# Altium schematic sheet Input_Protection.SchDoc
size A; SheetNumber: 2; SheetTotal: 4
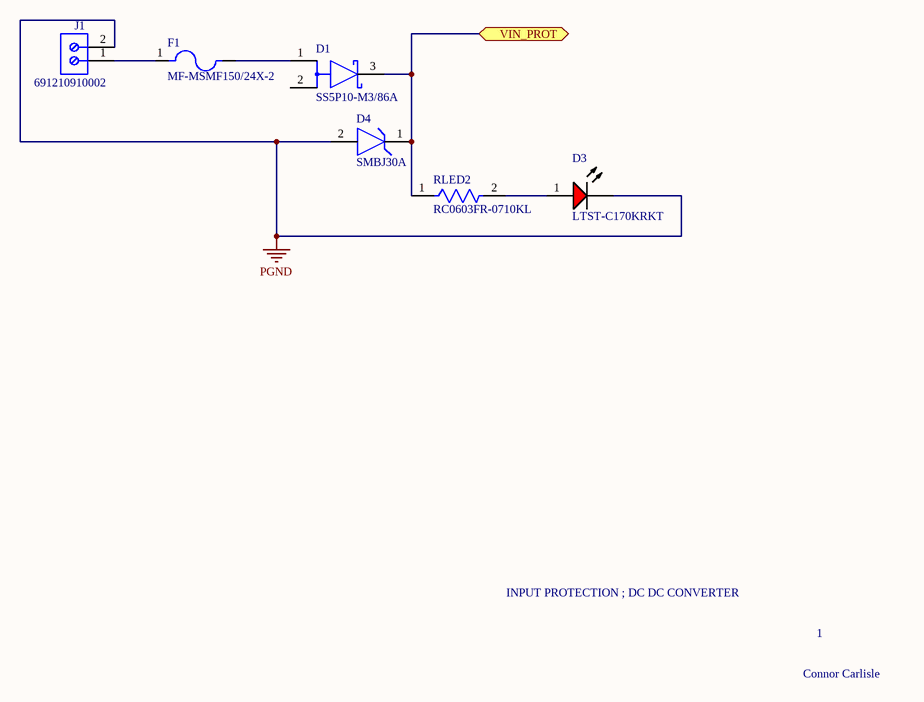
[diagram p0: Input_Protection.SchDoc]

## Parts
D1  SS5P10-M3/86A  [FP-95570-MFG]
D3  LTST-C170KRKT  [LTST-C170KRKT_V]
D4  SMBJ30A  [FP-DO-214AA_SMB_J-Bend-MFG]
F1  MF-MSMF150/24X-2  [FUSER_MF-MSMF150/24X-2]
J1  691210910002  [691210910002]
RLED2  RC0603FR-0710KL  [FP-RC0603-0_55-IPC_C]

## Ports
VIN_PROT (bidir, see Top[2B], Controller[1A], Controller[1C], Controller[4C], Power_Stage[1B])

## Nets
PGND: D3.2(K) D4.2(A) J1.2
VIN_PROT: D1.3(C) D4.1(C) RLED2.1 ; port VIN_PROT
NetD1_1: D1.1(A) F1.2
NetD3_1: D3.1(A) RLED2.2
NetF1_1: F1.1 J1.1

Not connected (* = marked no-connect by the designer): D1 2(A)

## Notes on the sheet
- INPUT PROTECTION ; DC DC CONVERTER
- 1
- Connor Carlisle

## Library data of the parts
D1 = CMP-02539-000057-1: DIODE SCHOTTKY 100V 5A TO277A; Max Forward Surge Current (Ifsm): 150A; Element Configuration: Common Cathode; Max Reverse Leakage Current: 15uA; Forward Voltage: 880mV; Case/Package: TO-277A; Number of Pins: 3; Max Reverse Voltage (DC): 100V; Height: 0.031inch; Peak Non-Repetitive Surge Current: 150A; Series: eSMP®; Radiation Hardening: No; Length: 0.242inch; Max Repetitive Reverse Voltage (Vrrm): 100V; Forward Current: 5A; Width: 0.171inch; Min Operating Temperature: -55°C; Max Surge Current: 150A; Lead Free: Lead Free; RoHS Compliant: Yes; Average Rectified Current: 5A; Max Operating Temperature: 150°C; Max Reverse Current: 15uA; Package Quantity: 1500; Packaging: Tape and Reel; Mount: Surface Mount
D3 = CMP-2000-07593-1: LED Red, 75 mW, 54 mcd, -55 to 85 degC, 2-Pin SMD, RoHS, Tape and Reel; Manufacturer: Lite-On; Lens Transparency: Clear; Number of Elements: 1; Power Rating: 75mW; Luminous Intensity: 54mcd; Viewing Angle: 130degrees; Forward Current: 30mA; Wavelength: 639nm; Lens Style: Rectangular; Case\/Package: 0805; Test Current: 20mA; Dominant Wavelength: 631nm; Forward Voltage: 2V; Lens Colour: Colorless; Min Operating Temperature: -55degC; RoHSCompliant: True; Length: 3.2mm; Width: 1.25mm; Mount: SurfaceMount; Packaging: TapeandReel; Number of LEDs: 1; Radiation Hardening: No; Datasheet URL: http://optoelectronics.liteon.com/upload/download/DS-22-99-0150/LTST-C170KRKT.pdf; Datasheet Version: Rev. D, 11/2014; Case Code (Metric): 2012; Height: 1.1mm; Number of Pins: 2; Package Description: 2-Pin Surface Mount Device, Body 2 x 1.25 mm; Manufacturer URL: http://www.us.liteon.com/; Lead Free: LeadFree; Illumination Colour: Red; Colour: Red; Case Code (Imperial): 0805; Max Operating Temperature: 85degC; Power Dissipation: 75mW; Mounting Technology: SurfaceMount; Package Reference: C170KRKT; Package Quantity: 1; Depth: 1.6mm
D4 = CMP-00227-00050034-1: SMBJ30A SMBJ Series 48.4 V 0.6 kW Surface Mount Uni-Directional TVS Diode - DO-214AA; NexarPartId: 50034; Manufacturer Package Identifier: DO-214AA (SMB J-Bend); Max Power Dissipation: 5W; Number of Channels: 1; Leakage Current: 1µA; Reverse Breakdown Voltage: 33.3V; Test Current: 1mA; Reverse Voltage: 30V; Element Configuration: Single; Max Breakdown Voltage: 36.8V; Max Surge Current: 12.4A; Polarity: Unidirectional; Power Rating: 600W; Current: 62A; Max Junction Temperature (Tj): 150°C; Power Line Protection: No; Clamping Voltage: 48.4V; Composition: Zener; Number of Elements: 1; Length: 4.57mm; Operating Supply Voltage: 30V; Case/Package: SMB; Number of Pins: 2; Voltage Rating (DC): 30V; Min Operating Temperature: -65°C; Number of Unidirectional Channels: 1; Height: 2.237mm; Lifecycle Status: Production; REACH SVHC: No SVHC; Max Reverse Leakage Current: 1µA; Power Dissipation: 600W; Direction: Unidirectional; Mount: Surface Mount; RoHS: Compliant; Reverse Standoff Voltage: 30V; Schedule B: 8541100080, 8541100080; Termination: SMD/SMT; Max Operating Temperature: 150°C; Packaging: Tape & Reel; Peak Pulse Current: 12.4A; Min Breakdown Voltage: 33.3V; Width: 3.94mm; Lead Free: Lead Free; Peak Pulse Power: 600W; Voltage: 30V; Radiation Hardening: No; Breakdown Voltage: 33.3V
F1 = CMP-005-00016-1: Polymeric PTC Resettable Fuse 24V 1.5 A Ih Surface Mount 1812 (4532 Metric), Concave; MF: Bourns; Design Item ID: MF-MSMF150/24X-2; Digi-Key_Part_Number: MF-MSMF150/24X-2TR-ND; MP: MF-MSMF150/24X-2; Check_prices: https://www.snapeda.com/parts/MF-MSMF150/24X-2/Bourns/view-part/?ref=eda; SnapEDA_Link: https://www.snapeda.com/parts/MF-MSMF150/24X-2/Bourns/view-part/?ref=snap; Source: MF-MSMF150_24X-2.SchLib; Component Type: Standard; Purchase-URL: https://pricing.snapeda.com/search/part/MF-MSMF150/24X-2/?ref=eda; Value: *; Case/Package: 1812 Bourns; Pins: 2
J1 = CMP-1502-02456-3: Tb, Wire To Brd, R/A, 2Way, 18Awg Rohs Compliant: Yes; Voltage Rating: 150V; Number of Contacts: 2; Current Rating: 6A; RoHS: Compliant; Number of Rows: 1; Max Operating Temperature: 105°C; Height: 8.7mm; Contact Material: Tin; Min Operating Temperature: -40°C
RLED2 = CMP-2100-03664-2: RES 10K OHM 1% 1/10W 0603; Voltage Rating: 75V; Voltage Rating (DC): 50V; Resistance: 10kR; Power Rating: 100mW; Temperature Coefficient: 100ppm/°C; Depth: 0.8mm; Termination: SMD/SMT; Resistor Type: Thick Film; Series: RC; Construction: Rectangular; Features: Moisture Resistant; Packaging: Tape and Reel; Min Operating Temperature: -55°C; Number of Terminations: 2; Lead Pitch: 0.3mm; RoHS Compliant: Yes; Case/Package: 0603; Resistance Tolerance: 1%; Military Standard: Not; Weight: 7.1E-05oz; Number of Pins: 2; Tolerance: 1%; Length: 1.6mm; Case Code (Imperial): 0603; Lead Free: Lead Free; Width: 0.8mm; Max Power Dissipation: 100mW; Height: 0.45mm; Max Operating Temperature: 155°C; Case Code (Metric): 1608; Size Code: 0603